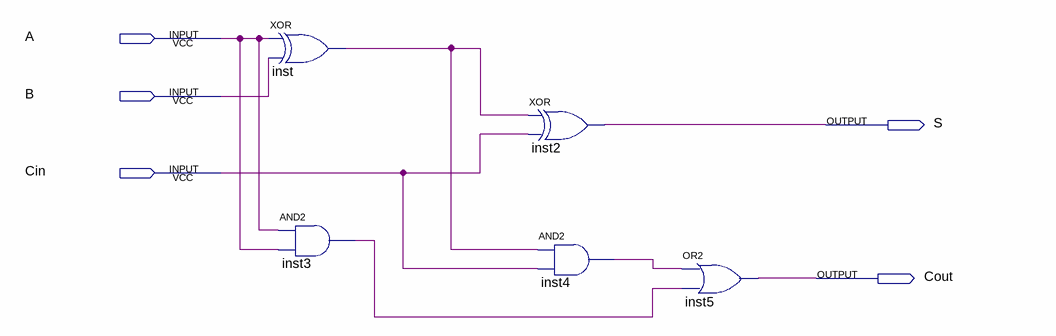
[diagram p0: schematic sheet]
// Quartus schematic fulladder.bdf as structural Verilog: 5 symbols, 5 pins
module fulladder (
  input  A,
  input  B,
  input  Cin,
  output S,
  output Cout
);

  wire inst3_out, inst4_out, inst_out;

  xor inst (inst_out, A, B);
  and inst3 (inst3_out, A, A);
  xor inst2 (S, inst_out, Cin);
  and inst4 (inst4_out, inst_out, Cin);
  or inst5 (Cout, inst4_out, inst3_out);
endmodule
